# EAGLE design BARRERA (EAGLE 7.2.0)
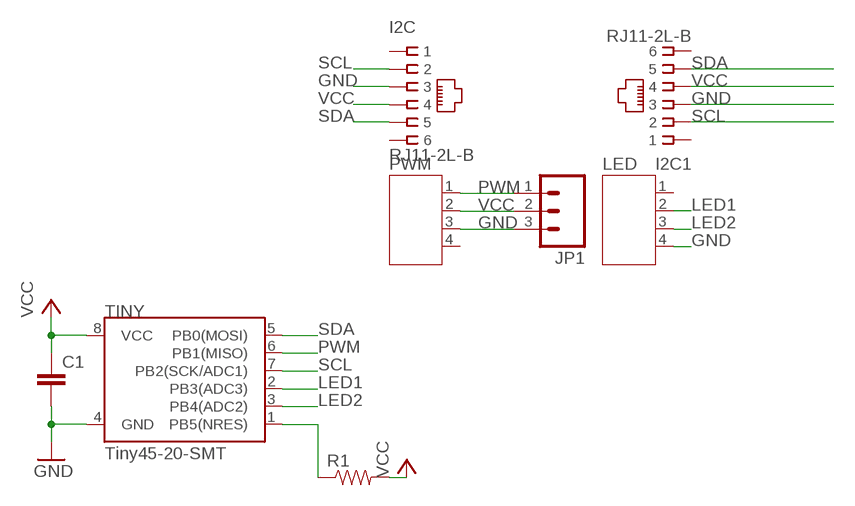
[diagram p0: schematic, sheet 1]

## Parts
C1  CAP0603-CAP  [0603-CAP]
I2C  RJ11-2L-B  [RJ11-NO_SHIELD]
I2C1  RJ11-2L-B  [RJ11-NO_SHIELD]
JP1  M03PTH  [1X03]
LED  JST-PH4  [JST-PH4]
PWM  JST-PH4  [JST-PH4]
R1  RESISTOR0603  [0603-RES]
TINY  Tiny45-20-SMT  ATTINY45TINY45-20-SMT  [SO08-EIAJ]

## Nets
GND: C1.2 I2C1.3 I2C.3 JP1.3 LED.4 PWM.3 TINY.4(GND)
LED1: LED.2 TINY.2(PB3(ADC3))
LED2: LED.3 TINY.3(PB4(ADC2))
N$3: R1.1 TINY.1(PB5(NRES))
PWM: JP1.1 PWM.1 TINY.6(PB1(MISO))
SCL: I2C1.2 I2C.2 TINY.7(PB2(SCK/ADC1))
SDA: I2C1.5 I2C.5 TINY.5(PB0(MOSI))
VCC: C1.1 I2C1.4 I2C.4 JP1.2 PWM.2 R1.2 TINY.8(VCC)
Unconnected: I2C1.1 I2C1.6 I2C.1 I2C.6 LED.1 PWM.4

## Library data of the parts
C1 = SparkFun-Capacitors:CAP: Capacitor Standard 0603 ceramic capacitor, and 0.1" leaded capacitor.
I2C I2C1 = con-tycoelectronics:RJ11: CORCOM Modular RJ Jacks No Shield Source: www.tycoelectronics.com .. ENG_DS_1654001_1099_RJ_L_0507.pdf; MF: TYCO ELECTRONICS; MPN: RJ11-2L-B; OC_FARNELL: unknown; OC_NEWARK: 83F4463
JP1 = SparkFun:M03: Header 3 Standard 3-pin 0.1" header. Use with straight break away headers (SKU : PRT-00116), right angle break away headers (PRT-00553), swiss pins (PRT-00743), machine pins (PRT-00117), and female headers (PRT-00115). Molex polarized connector foot print use with SKU : PRT-08232 with associated crimp pins and housings.
LED PWM = jst-ph:JST-PH4
R1 = SparkFun-Resistors:RESISTOR: Resistor Basic schematic elements and footprints for 0603, 1206, and PTH resistors.
TINY = SparkFun-DigitalIC:ATTINY45: Atmel 8-pin 2/4/8kB flash uC; PROD_ID: IC-08922

## Board
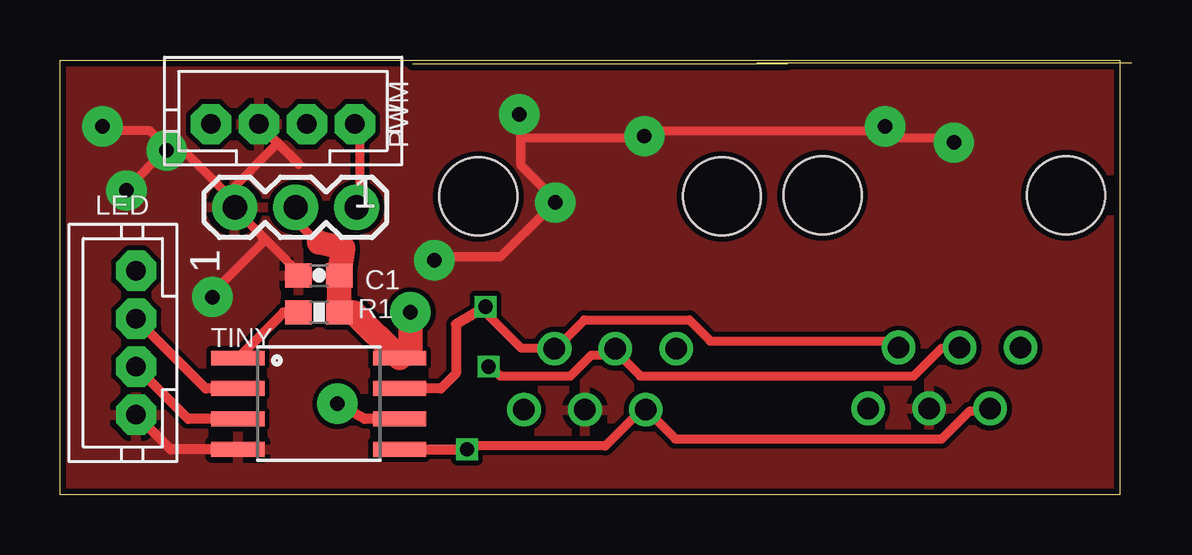
[diagram p1: board, top side]
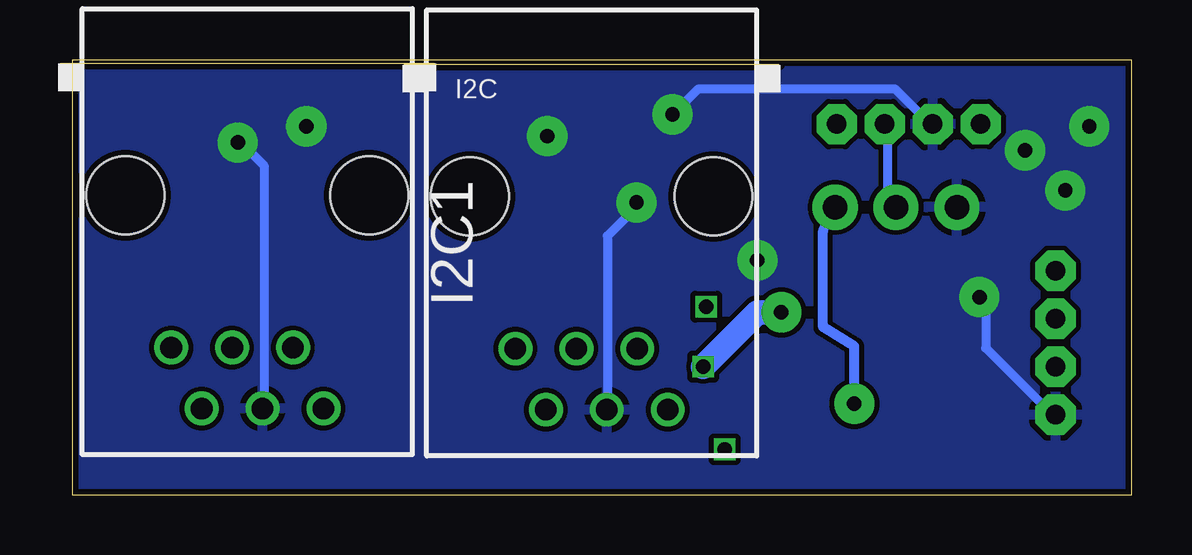
[diagram p2: board, bottom side, seen from below]

Size 44.17 x 18.14 mm. Coordinates in mm from the lower left corner, seen from the top.
Outline: 0,0 0,18.14 44.17,18.14 44.17,0 0,0
Copper layers (1*16): Top 0.035mm / dielectric 1.5mm / Bottom 0.035mm
Design rules "ITEADstudio_DRC *": minimum track width 15mil, minimum drill 12mil, track to track 8mil, track to pad 8mil, pad to pad 8mil, via to via 8mil, smd to smd 0mil, copper to edge 10mil, drill to drill 10mil, minimum pad ring 10mil, minimum via ring 6mil, stop-mask expansion 2mil, vias tented up to drill 100mil, thermal gap 10mil

### Footprints (pad centres in the part's own frame; a part is rotated, then mirrored left to right if it is on the bottom)
0603-CAP = smd 1.1 x 1: 1 -0.85,0; 2 0.85,0
RJ11-NO_SHIELD = drill 0.9 pad 1.4: 1 -3.175,8.89; 2 -1.905,6.35; 3 -0.635,8.89; 4 0.635,6.35; 5 1.905,8.89; 6 3.175,6.35 | hole 3.251: -5.08,0; 5.08,0
1X03 = drill 1.016 pad 1.88: 1 0,0; 2 2.54,0; 3 5.08,0
JST-PH4 = drill 0.813 pad 1.676 octagon: 1 3,0; 2 1,0; 3 -1,0; 4 -3,0
0603-RES = smd 1.1 x 1: 1 -0.85,0; 2 0.85,0
SO08-EIAJ = smd 0.61 x 2.21: 1 -1.905,-3.378; 2 -0.635,-3.378; 3 0.635,-3.378; 4 1.905,-3.378; 5 1.905,3.353; 6 0.635,3.353; 7 -0.635,3.353; 8 -1.905,3.353

### Placement (x,y rotation side)
C1  10.79,9.16 180 top
I2C  22.51,12.45 180 bottom
I2C1  36.87,12.5 180 bottom
JP1  12.37,12 180 top
LED  3.17,6.35 90 top
PWM  9.29,15.47 0 top
R1  10.79,7.62 0 top
TINY  10.79,3.81 270 top

### Tracks (layer width: path | path; a pad name or v marks a point on that pad's centre or on a via)
GND  (via drill 0.6 pad 1.68)
  Top 0.381: v1.77,15.38 1.99,15.19 3.75,15.19 4.33,14.61 v4.45,14.38 | v2.77,12.7 2.87,12.85 4.33,14.31 v4.45,14.38 | 8.42,10.81 7.25,11.98 JP1.3 | 8.42,10.81 9.88,9.35 C1.2 | 8.42,10.81 8.42,10.52 6.38,8.47 v6.35,8.26 | 6.96,12.56 7.25,12.27 JP1.3 | 6.96,12.56 5.21,14.31 4.62,14.31 v4.45,14.38 | 6.96,12.56 9.08,14.68 | 6.96,12.56 JP1.3 | v37.27,14.7 37.05,14.9 34.71,14.9 34.42,15.19 v34.4,15.38 34.12,15.19 24.49,15.19 v24.36,14.97 24.19,14.9 19.23,14.9 | v15.6,9.79 15.72,9.93 18.35,9.93 20.4,11.98 v20.64,12.2 20.69,12.27 19.23,13.73 19.23,14.9 | 19.23,14.9 19.23,15.77 v19.14,15.88
  Top 0.406: TINY.4 4.62,1.91 LED.4 | 9.95,13.82 9.08,14.68 PWM.3
  Bottom 0.381: LED.4 3.45,3.5 6.08,6.13 6.08,8.18 v6.35,8.26 | I2C.3 21.86,3.8 21.86,10.81 20.69,11.98 v20.64,12.2 | I2C1.3 36.17,3.8 36.17,13.73 37.05,14.61 v37.27,14.7 | PWM.3 8.42,15.48 9.88,16.94 18.06,16.94 18.94,16.07 v19.14,15.88
  pour Bottom: -1.64,21 -1.64,-2 45.87,-2 45.87,20.5 45.87,21
  pour Top: -1.64,21 45.87,21 45.87,-2 -1.64,-2
LED1
  Top 0.406: TINY.2 6.08,4.45 LED.2
LED2
  Top 0.406: TINY.3 5.35,3.17 LED.3
N$3
  Top 0.406: TINY.1 9.32,7.62 R1.1
PWM  (via drill 0.6 pad 1.68)
  Top 0.381: PWM.1 12.51,15.19 12.51,12.27 JP1.1
  Top 0.406: TINY.6 12.7,3.17 v11.56,3.81
  Bottom 0.406: v11.56,3.81 11.56,6.2 12.87,7 12.87,11 JP1.1
SCL  (via drill 0.6)
  Top 0.381: v17.74,7.85 17.77,7.59 19.23,6.13 20.4,6.13 I2C.2 20.69,6.13 21.86,7.3 26.24,7.3 27.11,6.43 34.71,6.43 I2C1.2
  Top 0.406: v17.74,7.85 16.51,7.12 16.51,5.08 15.88,4.45 TINY.7
SDA  (via drill 0.6)
  Top 0.381: v16.97,1.91 17.18,2.04 22.73,2.04 24.19,3.5 I2C.5 24.49,3.5 25.65,2.34 36.75,2.34 37.92,3.5 38.51,3.5 I2C1.5
  Top 0.406: TINY.5 v16.97,1.91
VCC  (via drill 0.6, 0.6 pad 1.68)
  Top 0.381: v17.86,5.35 18.06,5.26 18.35,4.97 21.27,4.97 22.15,5.84 23.02,5.84 I2C.4 23.32,5.84 24.19,4.97 35.59,4.97 36.75,6.13 37.34,6.13 I2C1.4 | JP1.2 9.88,11.98 9.88,11.39 10.46,10.81 10.79,10.53
  Top 0.406: 13.55,5.71 TINY.8 14.61,6.17
  Top 1.016: TINY.8 12.24,7.62 R1.2 C1.1 11.79,10.31 10.79,10.53 | 14.61,6.17 v14.61,7.62
  Bottom 0.381: PWM.2 10.17,15.19 10.17,12.56 9.88,12.27 JP1.2
  Bottom 0.406: v17.86,5.35 v17.88,5.35
  Bottom 1.016: v14.61,7.62 15.6,7.62 v17.86,5.35